# Altium schematic sheet LCD_TFT_Module.SchDoc
size A; SheetNumber: 1; SheetTotal: 6
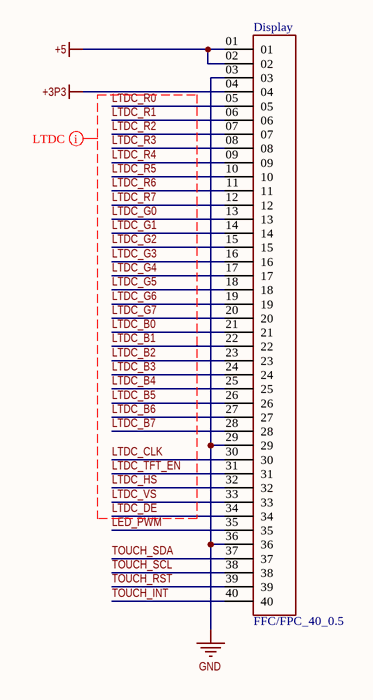
[diagram p0: LCD_TFT_Module.SchDoc]

## Parts
Display  FFC/FPC_40_0.5  [FFC_40_0.5mm]

## Nets
+3P3: Display.04
+5: Display.01 Display.02
GND: Display.03 Display.29 Display.36
LED_PWM: Display.35
LTDC_B0: Display.21
LTDC_B1: Display.22
LTDC_B2: Display.23
LTDC_B3: Display.24
LTDC_B4: Display.25
LTDC_B5: Display.26
LTDC_B6: Display.27
LTDC_B7: Display.28
LTDC_CLK: Display.30
LTDC_DE: Display.34
LTDC_G0: Display.13
LTDC_G1: Display.14
LTDC_G2: Display.15
LTDC_G3: Display.16
LTDC_G4: Display.17
LTDC_G5: Display.18
LTDC_G6: Display.19
LTDC_G7: Display.20
LTDC_HS: Display.32
LTDC_R0: Display.05
LTDC_R1: Display.06
LTDC_R2: Display.07
LTDC_R3: Display.08
LTDC_R4: Display.09
LTDC_R5: Display.10
LTDC_R6: Display.11
LTDC_R7: Display.12
LTDC_TFT_EN: Display.31
LTDC_VS: Display.33
TOUCH_INT: Display.40
TOUCH_RST: Display.39
TOUCH_SCL: Display.38
TOUCH_SDA: Display.37

## Layout directives
net class LTDC: LTDC_B0, LTDC_B1, LTDC_B2, LTDC_B3, LTDC_B4, LTDC_B5, LTDC_B6, LTDC_B7, LTDC_CLK, LTDC_DE, LTDC_G0, LTDC_G1, LTDC_G2, LTDC_G3, LTDC_G4, LTDC_G5, LTDC_G6, LTDC_G7, LTDC_HS, LTDC_R0, LTDC_R1, LTDC_R2, LTDC_R3, LTDC_R4, LTDC_R5, LTDC_R6, LTDC_R7, LTDC_TFT_EN, LTDC_VS

## Library data of the parts
Display = FFC/FPC_40_0.5: MF: Samtec; MP: ZF5S-40-02-T-WT; Package: None; Availability: Unavailable; Value: *; Price: None